# EAGLE design H-bridge_double (EAGLE 7.1.0)
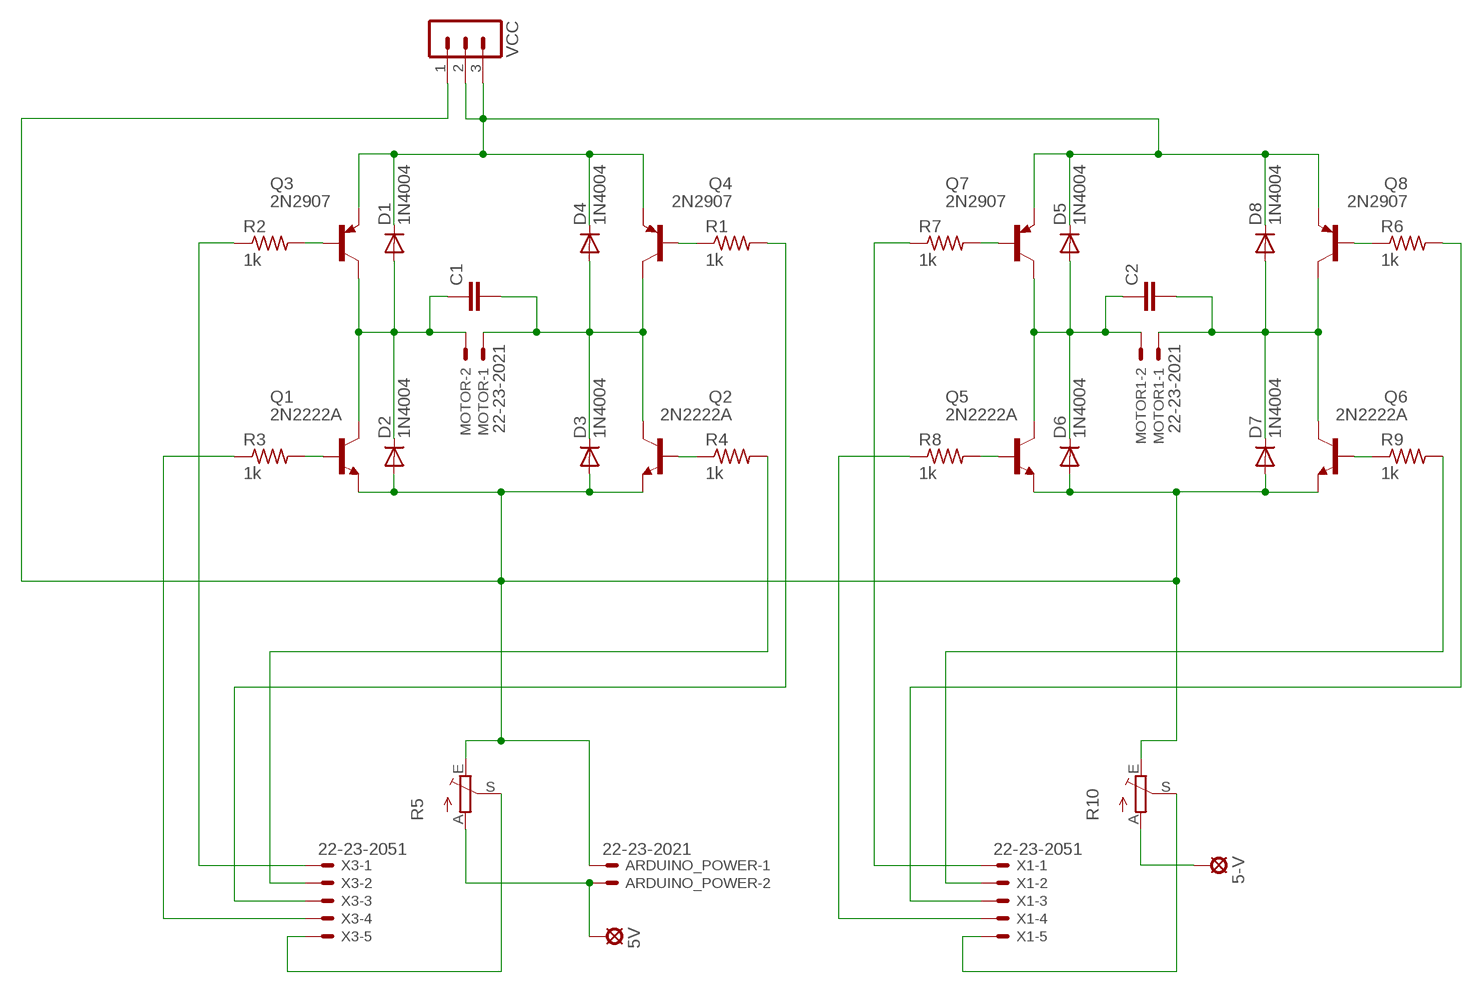
[diagram p0: schematic, sheet 1]

## Parts
5-V  LSP10  [LSP10]
5V  LSP10  [LSP10]
ARDUINO_POWER  22-23-2021  [22-23-2021]
C1  C2.5/2  [C2.5-2]
C2  C2.5/2  [C2.5-2]
D1  1N4004  [DO41-10]
D2  1N4004  [DO41-10]
D3  1N4004  [DO41-10]
D4  1N4004  [DO41-10]
D5  1N4004  [DO41-10]
D6  1N4004  [DO41-10]
D7  1N4004  [DO41-10]
D8  1N4004  [DO41-10]
MOTOR  22-23-2021  [22-23-2021]
MOTOR1  22-23-2021  [22-23-2021]
Q1  2N2222A  [TO18]
Q2  2N2222A  [TO18]
Q3  2N2907  [TO18]
Q4  2N2907  [TO18]
Q5  2N2222A  [TO18]
Q6  2N2222A  [TO18]
Q7  2N2907  [TO18]
Q8  2N2907  [TO18]
R1  1k  R-US_0309/12  [0309/12]
R2  1k  R-US_0309/12  [0309/12]
R3  1k  R-US_0309/12  [0309/12]
R4  1k  R-US_0309/12  [0309/12]
R5  TRIM_EU-CA6V  [CA6V]
R6  1k  R-US_0309/12  [0309/12]
R7  1k  R-US_0309/12  [0309/12]
R8  1k  R-US_0309/12  [0309/12]
R9  1k  R-US_0309/12  [0309/12]
R10  TRIM_EU-CA6V  [CA6V]
VCC  MA03-1  [MA03-1]
X1  22-23-2051  [22-23-2051]
X3  22-23-2051  [22-23-2051]

## Nets
GND: ARDUINO_POWER.1 D2.A D3.A D6.A D7.A Q1.1(E) Q2.1(E) Q5.1(E) Q6.1(E) R5.E R10.E VCC.1
N$1: Q4.2(B) R1.1
N$2: Q2.2(B) R4.1
N$3: C1.2 D3.C D4.A MOTOR.1 Q2.3(C) Q4.3(C)
N$4: Q8.2(B) R6.1
N$5: R3.1 X3.4
N$6: Q6.2(B) R9.1
N$7: R4.2 X3.2
N$8: C1.1 D1.A D2.C MOTOR.2 Q1.3(C) Q3.3(C)
N$9: D1.C D4.C D5.C D8.C Q3.1(E) Q4.1(E) Q7.1(E) Q8.1(E) VCC.2 VCC.3
N$10: Q3.2(B) R2.2
N$11: Q1.2(B) R3.2
N$12: R5.S X3.5
N$13: R2.1 X3.1
N$14: R1.2 X3.3
N$15: 5-V.MP R10.A
N$16: C2.2 D7.C D8.A MOTOR1.1 Q6.3(C) Q8.3(C)
N$17: R9.2 X1.2
N$18: C2.1 D5.A D6.C MOTOR1.2 Q5.3(C) Q7.3(C)
N$19: 5V.MP ARDUINO_POWER.2 R5.A
N$20: Q7.2(B) R7.2
N$21: Q5.2(B) R8.2
N$22: R7.1 X1.1
N$23: R8.1 X1.4
N$24: R6.2 X1.3
N$25: R10.S X1.5

## Library data of the parts
5-V 5V = solpad:LSP10: SOLDER PAD drill 1.0 mm, distributor Buerklin, 12H555
ARDUINO_POWER MOTOR MOTOR1 = con-molex:22-23-2021: .100" (2.54mm) Center Header - 2 Pin; MF: MOLEX; MPN: 22-23-2021; OC_FARNELL: 1462926; OC_NEWARK: 25C3832
C1 C2 = capacitor-wima:C: CAPACITOR naming: grid - package width
D1-D8 = adafruit:1N4004: DIODE General purpose 1N400x type rectifier (With bigger pads) http://www.ladyada.net/library/pcb/eaglelibrary.html
Q1 Q2 Q5 Q6 = transistor-npn:2N2222*: NPN Transistor
Q3 Q4 Q7 Q8 = transistor-pnp:2N2907*: PNP Transistor
R1-R4 R6-R9 = adafruit:R-US_: RESISTOR, American symbol
R5 R10 = pot:TRIM_EU-: POTENTIOMETER
VCC = con-lstb:MA03-1: PIN HEADER; OC_FARNELL: unknown; OC_NEWARK: unknown
X1 X3 = con-molex:22-23-2051: .100" (2.54mm) Center Header - 5 Pin; MF: MOLEX; MPN: 22-23-2051; OC_FARNELL: 1462952; OC_NEWARK: 38C9178

## Board
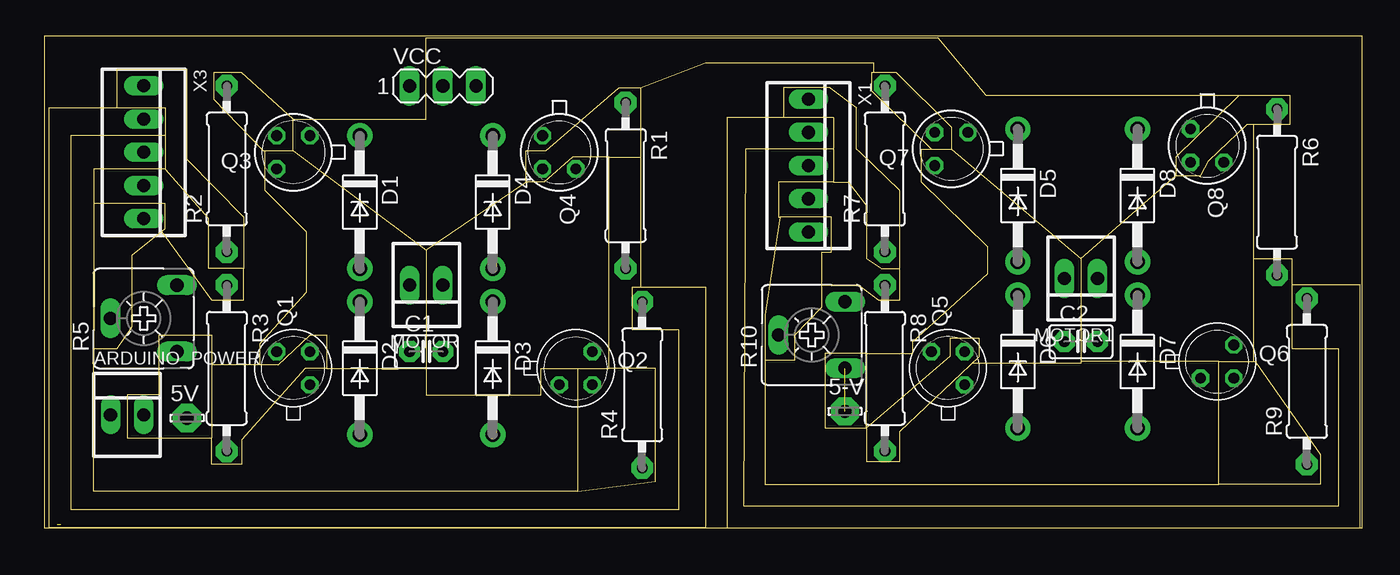
[diagram p1: board, top side]
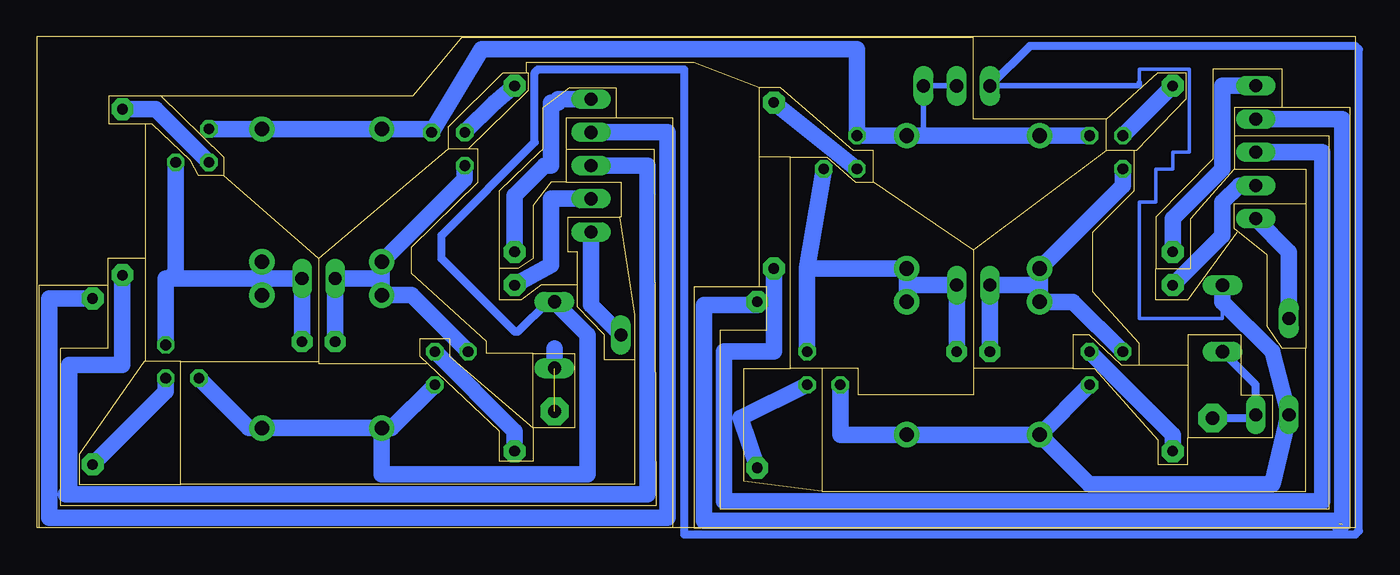
[diagram p2: board, bottom side, seen from below]

Size 100.76 x 37.58 mm. Coordinates in mm from the lower left corner, seen from the top.
Outline: 0,0 100.76,0 100.76,37.58 0,37.58 0,0
Copper layers (1*16): Top 0.035mm / dielectric 1.5mm / Bottom 0.035mm
Design rules "default": minimum track width 10mil, minimum drill 24mil, track to track 8mil, track to pad 8mil, pad to pad 8mil, via to via 8mil, smd to smd 8mil, copper to edge 40mil, drill to drill 8mil, minimum pad ring 10mil, minimum via ring 8mil, stop-mask expansion 4mil, vias tented up to drill 0mil, thermal gap 10mil
Milling: 194 lines

### Footprints (pad centres in the part's own frame; a part is rotated, then mirrored left to right if it is on the bottom)
LSP10 = drill 1.016 pad 2.159 octagon: MP 0,0
22-23-2021 = drill 1 long: 1 -1.27,0; 2 1.27,0
C2.5-2 = drill 0.813 pad 1.6 octagon: 1 -1.27,0; 2 1.27,0
DO41-10 = drill 1.118 pad 1.93: A 5.08,0; C -5.08,0
TO18 = drill 0.813 octagon: 1 -1.27,-1.27; 2 1.27,-1.27; 3 1.27,1.27
0309/12 = drill 0.813 pad 1.676 octagon: 1 -6.35,0; 2 6.35,0
CA6V = drill 1.016 long: A -2.54,-2.54; E 2.54,-2.54; S 0,2.54
MA03-1 = drill 1.016 long: 1 -2.54,0; 2 0,0; 3 2.54,0
22-23-2051 = drill 1 long: 1 -5.08,0; 2 -2.54,0; 3 0,0; 4 2.54,0; 5 5.08,0

### Placement (x,y rotation side)
5-V  61.21,8.89 0 top
5V  10.92,8.38 0 top
ARDUINO_POWER  6.35,8.64 0 top
C1  29.21,13.46 0 top
C2  79.25,14.22 0 top
D1  24.13,24.89 270 top
D2  24.13,12.19 270 top
D3  34.29,12.19 270 top
D4  34.29,24.89 270 top
D5  74.42,25.4 270 top
D6  74.42,12.7 270 top
D7  83.57,12.7 270 top
D8  83.57,25.4 270 top
MOTOR  29.21,18.54 180 top
MOTOR1  79.25,19.05 180 top
Q1  19.05,12.19 90 top
Q2  40.64,12.19 0 top
Q3  19.05,28.7 180 top
Q4  39.37,28.7 270 top
Q5  69.09,12.19 90 top
Q6  89.66,12.7 0 top
Q7  69.34,28.96 180 top
Q8  88.9,29.21 270 top
R1  44.45,26.16 270 top
R2  13.97,27.43 90 top
R3  13.97,12.19 270 top
R4  45.72,10.92 90 top
R5  7.62,16 90 top
R6  94.23,25.65 270 top
R7  64.26,27.43 90 top
R8  64.26,12.19 270 top
R9  96.52,11.18 90 top
R10  58.67,14.73 90 top
VCC  30.48,33.78 0 top
X1  58.42,27.69 270 top
X3  7.62,28.7 270 top

### Tracks (layer width: path | path; a pad name or v marks a point on that pad's centre or on a via)
GND
  Bottom 0.254: 16.51,34.04 16.51,35.05 12.7,35.05 12.7,28.7 13.97,28.7 13.97,27.43 15.24,27.43 15.24,24.89 16.51,24.89 16.51,16 10.16,16 R5.E
  Bottom 0.406: VCC.1 16.51,33.78 16.51,34.04
  Bottom 0.61: R10.E 61.72,17.27 64.01,14.99 64.26,14.99 69.85,20.57 69.85,22.35 62.74,29.46 62.74,34.8 62.48,35.05 51.31,35.05 51.31,-0.51 0,-0.51 -0.25,-0.25 -0.25,36.58 0,36.83 24.89,36.83 VCC.1
  Bottom 1.27: Q2.1 39.37,7.11 D3.A D2.A | Q1.1 D2.A | D2.A 20.32,3.3 6.35,3.3 ARDUINO_POWER.1 6.35,13.46 10.16,17.27 R5.E | D6.A 73.66,7.62 Q5.1 | D6.A D7.A 84.58,7.62 Q6.1 | R10.E 58.67,14.73 58.67,4.06 74.42,4.06 D6.A
N$1
  Bottom 1.27: Q4.2 R1.1
N$2
  Bottom 1.27: Q2.2 46.99,8.38 R4.1
N$3
  Bottom 1.27: C1.2 MOTOR.1 34.29,18.54 D4.A | Q4.3 41.91,19.81 | 41.91,19.81 D4.A | Q2.3 41.91,19.81 | D3.C D4.A
N$4
  Bottom 1.27: Q8.2 91.69,32 R6.1
N$5
  Bottom 1.27: R3.1 10.16,22.35 10.16,24.89 8.89,26.16 X3.4
N$6
  Bottom 1.27: Q6.2 90.93,10.41 R9.1
N$7  (1 unrouted)
  Bottom 1.27: X3.2 1.02,31.24 1.02,0.25 | R4.2 45.72,17.02 49.78,17.02 49.78,0.51 1.27,0.51 1.27,0.25
N$8
  Bottom 1.27: C1.1 MOTOR.2 24.13,18.54 | Q3.3 17.78,26.16 D1.A 24.13,18.54 | 24.13,18.54 D2.C 21.59,17.27 Q1.3
N$9
  Bottom 0.406: VCC.2 VCC.3 33.02,29.97
  Bottom 1.27: Q3.1 D1.C 33.02,29.97 D4.C Q4.1 38.1,36.58 66.8,36.58 Q7.1 70.61,30.48 D5.C D8.C Q8.1
N$10
  Bottom 1.27: Q3.2 R2.2
N$11
  Bottom 1.27: Q1.2 13.97,7.11 R3.2
N$12
  Bottom 1.27: R5.S 5.08,21.08 X3.5
N$13
  Bottom 1.27: X3.1 10.16,33.78 10.16,27.43 13.97,23.62 R2.1
N$14
  Bottom 1.27: X3.3 2.54,28.7 2.54,2.03 48.26,2.03 48.26,13.46 44.45,13.46 R1.2
N$15  (1 unrouted)
  Bottom 1.27: R10.A 61.21,13.72
N$16
  Bottom 1.27: C2.2 MOTOR1.1 83.57,19.05 | D7.C 83.57,19.05 | 83.57,19.05 D8.A | Q6.3 90.93,19.05 90.68,19.05 | 90.68,19.05 83.57,19.05 | Q8.3 90.17,19.56 90.68,19.05
N$17
  Bottom 1.27: R9.2 99.82,17.53 99.82,0.76 52.58,0.76 52.58,30.23 X1.2
N$18
  Bottom 1.27: 74.42,19.05 MOTOR1.2 C2.1 | 74.42,19.05 D5.A 68.07,26.67 Q7.3 | 74.42,19.05 D6.C 72.14,17.78 Q5.3
N$19
  Bottom 0.61: 5V.MP 7.87,8.38 ARDUINO_POWER.2 7.62,10.92 R5.A
N$20
  Bottom 1.27: R7.2 65.79,32.51 Q7.2
N$21
  Bottom 1.27: Q5.2 64.26,7.37 R8.2
N$22
  Bottom 1.27: X1.1 60.96,32.77 60.96,32.51 61.47,32.51 61.47,27.69 61.98,27.69 64.26,25.4 R7.1
N$23
  Bottom 1.27: R8.1 61.47,20.07 61.47,25.15 X1.4
N$24
  Bottom 1.27: X1.3 54.1,27.69 54.1,2.54 98.3,2.54 | 98.55,2.54 98.3,2.54 | 98.3,2.54 98.3,12.45 94.23,12.45 R6.2
N$25
  Bottom 1.27: X1.5 58.42,17.02 R10.S